# Altium schematic sheet Sheet1.SchDoc
size A
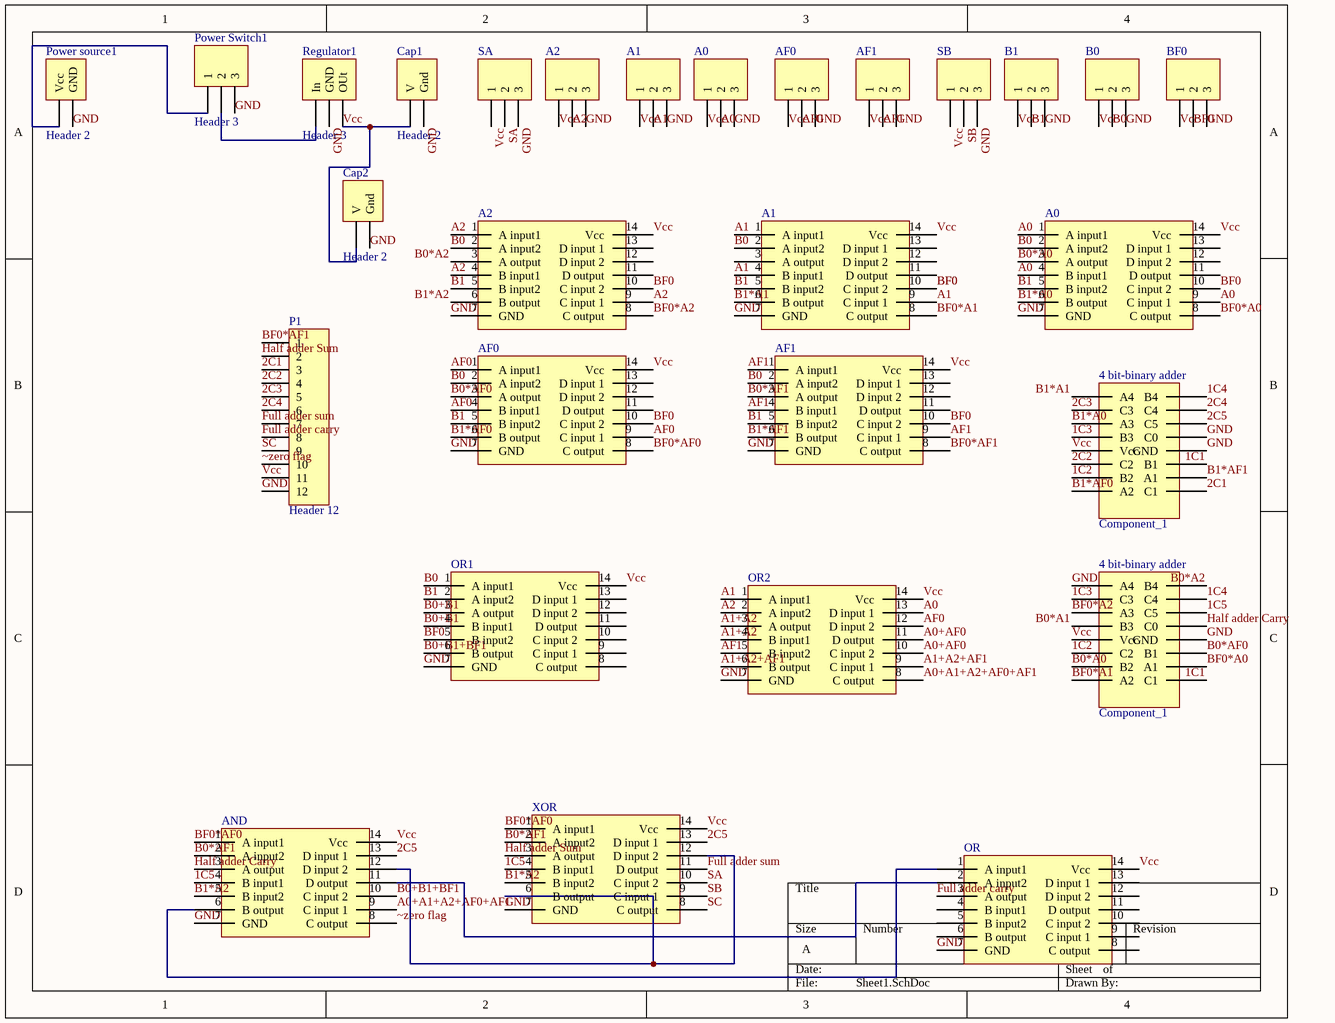
[diagram p0: Sheet1.SchDoc]

## Parts
(Parts that share a designator on the sheet are numbered #1, #2 ... from top to bottom, then left to right.)
4_bit-binary_adder#1  Component_1  [7483]
4_bit-binary_adder#2  Component_1  [7483]
A0#1  A0  [HDR1X3]  (value not drawn)
A0#2  A0  [Gate?]  (value not drawn)
A1#1  A1  [HDR1X3]  (value not drawn)
A1#2  A1  [Gate?]  (value not drawn)
A2#1  A2  [HDR1X3]  (value not drawn)
A2#2  A2  [Gate?]  (value not drawn)
AF0#1  AF0  [HDR1X3]  (value not drawn)
AF0#2  AF0  [Gate?]  (value not drawn)
AF1#1  AF1  [HDR1X3]  (value not drawn)
AF1#2  AF1  [Gate?]  (value not drawn)
AND  A2  [Gate?]  (value not drawn)
B0  B0  [HDR1X3]  (value not drawn)
B1  B1  [HDR1X3]  (value not drawn)
BF0  BF0  [HDR1X3]  (value not drawn)
Cap1  Header 2  [HDR1X2]
Cap2  Header 2  [HDR1X2]
OR  A2  [Gate?]  (value not drawn)
OR1  A2  [Gate?]  (value not drawn)
OR2  A2  [Gate?]  (value not drawn)
P1  Header 12  [HDR1X12]
Power_source1  Header 2  [HDR1X2]
Power_Switch1  Header 3  [HDR1X3]
Regulator1  Header 3  [HDR1X3]
SA  Header 3  [HDR1X3]  (value not drawn)
SB  Header 3  [HDR1X3]  (value not drawn)
XOR  A2  [Gate?]  (value not drawn)

## Nets
1C1: 4_bit-binary_adder#1.B1 4_bit-binary_adder#2.C1
1C2: 4_bit-binary_adder#1.B2 4_bit-binary_adder#2.C2
1C3: 4_bit-binary_adder#1.B3 4_bit-binary_adder#2.C3
1C4: 4_bit-binary_adder#1.B4 4_bit-binary_adder#2.C4
1C5: 4_bit-binary_adder#2.C5 AND.4(B_input1) XOR.4(B_input1)
2C1: 4_bit-binary_adder#1.C1 P1.3
2C2: 4_bit-binary_adder#1.C2 P1.4
2C3: 4_bit-binary_adder#1.C3 P1.5
2C4: 4_bit-binary_adder#1.C4 P1.6
2C5: 4_bit-binary_adder#1.C5 AND.13(D_input_1) XOR.13(D_input_1)
A0: A0#1.2 A0#2.1(A_input1) A0#2.4(B_input1) A0#2.9(C_input_1) OR2.13(D_input_1)
A0+A1+A2+AF0+AF1: AND.9(C_input_1) OR2.8(C_output)
A0+AF0: OR2.10(C_input_2) OR2.11(D_output)
A1: A1#1.2 A1#2.1(A_input1) A1#2.4(B_input1) A1#2.9(C_input_1) OR2.1(A_input1)
A1+A2: OR2.3(A_output) OR2.4(B_input1)
A1+A2+AF1: OR2.6(B_output) OR2.9(C_input_1)
A2: A2#1.2 A2#2.1(A_input1) A2#2.4(B_input1) A2#2.9(C_input_1) OR2.2(A_input2)
AF0: AF0#1.2 AF0#2.1(A_input1) AF0#2.4(B_input1) AF0#2.9(C_input_1) OR2.12(D_input_2)
AF1: AF1#1.2 AF1#2.1(A_input1) AF1#2.4(B_input1) AF1#2.9(C_input_1) OR2.5(B_input2)
B0: A0#2.2(A_input2) A1#2.2(A_input2) A2#2.2(A_input2) AF0#2.2(A_input2) AF1#2.2(A_input2) B0.2 OR1.1(A_input1)
B0*A0: 4_bit-binary_adder#2.B2 A0#2.3(A_output)
B0*A1: 4_bit-binary_adder#2.B3
B0*A2: 4_bit-binary_adder#2.B4 A2#2.3(A_output)
B0*AF0: 4_bit-binary_adder#2.B1 AF0#2.3(A_output)
B0*AF1: AF1#2.3(A_output) AND.2(A_input2) XOR.2(A_input2)
B0+B1: OR1.3(A_output) OR1.4(B_input1)
B0+B1+BF1: AND.10(C_input_2) OR1.6(B_output)
B1: A0#2.5(B_input2) A1#2.5(B_input2) A2#2.5(B_input2) AF0#2.5(B_input2) AF1#2.5(B_input2) B1.2 OR1.2(A_input2)
B1*A0: 4_bit-binary_adder#1.A3 A0#2.6(B_output)
B1*A1: 4_bit-binary_adder#1.A4 A1#2.6(B_output)
B1*A2: A2#2.6(B_output) AND.5(B_input2) XOR.5(B_input2)
B1*AF0: 4_bit-binary_adder#1.A2 AF0#2.6(B_output)
B1*AF1: 4_bit-binary_adder#1.A1 AF1#2.6(B_output)
BF0: A0#2.10(C_input_2) A1#2.10(C_input_2) A2#2.10(C_input_2) AF0#2.10(C_input_2) AF1#2.10(C_input_2) BF0.2 OR1.5(B_input2)
BF0*A0: 4_bit-binary_adder#2.A1 A0#2.8(C_output)
BF0*A1: 4_bit-binary_adder#2.A2 A1#2.8(C_output)
BF0*A2: 4_bit-binary_adder#2.A3 A2#2.8(C_output)
BF0*AF0: AF0#2.8(C_output) AND.1(A_input1) XOR.1(A_input1)
BF0*AF1: AF1#2.8(C_output) P1.1
Full adder carry: OR.3(A_output) P1.8
Full adder sum: P1.7 XOR.11(D_output)
GND: 4_bit-binary_adder#1.C0 4_bit-binary_adder#1.GND 4_bit-binary_adder#2.A4 4_bit-binary_adder#2.GND A0#1.3 A0#2.7(GND) A1#1.3 A1#2.7(GND) A2#1.3 A2#2.7(GND) AF0#1.3 AF0#2.7(GND) AF1#1.3 AF1#2.7(GND) AND.7(GND) B0.3 B1.3 BF0.3 Cap1.2(Gnd) Cap2.2(Gnd) OR.7(GND) OR1.7(GND) OR2.7(GND) P1.12 Power_source1.2(GND) Power_Switch1.3 Regulator1.2(GND) SA.3 SB.3 XOR.7(GND)
Half adder Carry: 4_bit-binary_adder#2.C0 AND.3(A_output)
Half adder Sum: P1.2 XOR.3(A_output)
SA: SA.2 XOR.10(C_input_2)
SB: SB.2 XOR.9(C_input_1)
SC: P1.9 XOR.8(C_output)
Vcc: 4_bit-binary_adder#1.Vcc 4_bit-binary_adder#2.Vcc A0#1.1 A0#2.14(Vcc) A1#1.1 A1#2.14(Vcc) A2#1.1 A2#2.14(Vcc) AF0#1.1 AF0#2.14(Vcc) AF1#1.1 AF1#2.14(Vcc) AND.14(Vcc) B0.1 B1.1 BF0.1 Cap1.1(V) Cap2.1(V) OR.14(Vcc) OR1.14(Vcc) OR2.14(Vcc) P1.11 Regulator1.3(OUt) SA.1 SB.1 XOR.14(Vcc)
~zero flag: AND.8(C_output) P1.10
NetAND_6: AND.6(B_output) OR.1(A_input1)
NetAND_11: AND.11(D_output) OR.2(A_input2)
NetAND_12: AND.12(D_input_2) XOR.6(B_output) XOR.12(D_input_2)
NetPower_source1_1: Power_source1.1(Vcc) Power_Switch1.1
NetPower_Switch1_2: Power_Switch1.2 Regulator1.1(In)

Not connected (* = marked no-connect by the designer): A0#2 11(D_output) 12(D_input_2) 13(D_input_1); A1#2 3(A_output) 11(D_output) 12(D_input_2) 13(D_input_1); A2#2 11(D_output) 12(D_input_2) 13(D_input_1); AF0#2 11(D_output) 12(D_input_2) 13(D_input_1); AF1#2 11(D_output) 12(D_input_2) 13(D_input_1); OR 4(B_input1) 5(B_input2) 6(B_output) 8(C_output) 9(C_input_1) 10(C_input_2) 11(D_output) 12(D_input_2) 13(D_input_1); OR1 8(C_output) 9(C_input_1) 10(C_input_2) 11(D_output) 12(D_input_2) 13(D_input_1)

## Library data of the parts
A0#1 A1#1 A2#1 AF0#1 AF1#1 B0 B1 BF0 Power_Switch1 Regulator1 SA SB = Header 3: Header, 3-Pin; LatestRevisionDate: 17-Jul-2002; LatestRevisionNote: Re-released for DXP Platform.; Publisher: Altium Limited
A0#2 A1#2 A2#2 AF0#2 AF1#2 AND OR OR1 OR2 XOR = Component_1
Cap1 Cap2 Power_source1 = Header 2: Header, 2-Pin; LatestRevisionDate: 17-Jul-2002; LatestRevisionNote: Re-released for DXP Platform.; Publisher: Altium Limited
P1 = Header 12: Header, 12-Pin; LatestRevisionDate: 17-Jul-2002; LatestRevisionNote: Re-released for DXP Platform.; Publisher: Altium Limited